# Altium schematic sheet BSPD23-ESF.SchDoc
size 355 x 193 mm
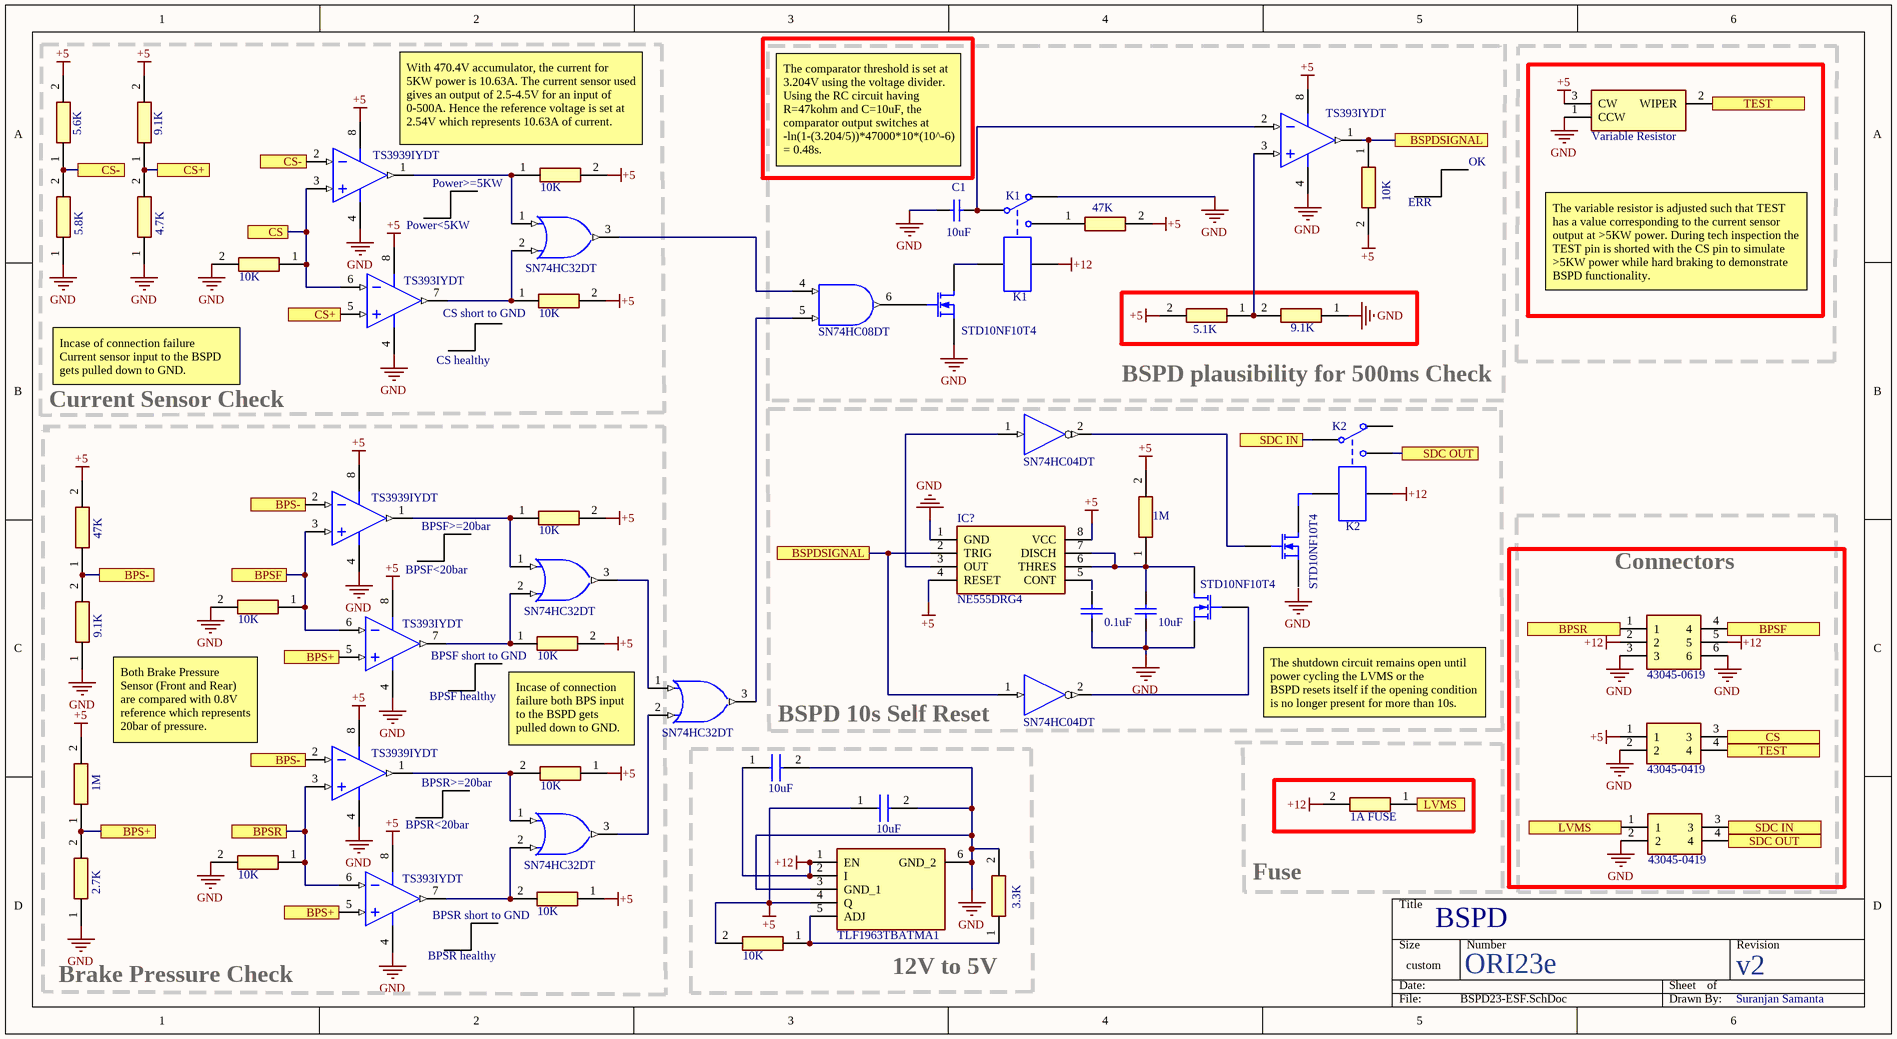
[diagram p0: BSPD23-ESF.SchDoc]

## Parts
(Parts that share a designator on the sheet are numbered #1, #2 ... from top to bottom, then left to right.)
?#1  TS393IYDT  [STM-SO-8_D_L]  (part B of 2)
?#2  STD10NF10T4  [E3]
?#3  TS393IYDT  [STM-SO-8_D_L]  (part B of 2)
?#4  TS393IYDT  [STM-SO-8_D_L]  (part B of 2)
C?#1  C1  value 10uF  [RAD-0.3]
C?#2  0.1uF  [RAD-0.3]
C?#3  10uF  [RAD-0.3]
C?#4  10uF  [CAPC3225X230N]
C?#5  10uF  [CAPC3225X230N]
IC?  NE555DRG4  [SOIC127P600X175-8N]
J?#1  43045-0619  [43045-06YY_181920]
J?#2  43045-0419  [43045-04YY_181920]
J?#3  43045-0419  [43045-04YY_181920]
K?#1  Relay-SPDT  [MODULE5B]  (value not drawn)
K?#2  Relay-SPDT  [MODULE5B]  (value not drawn)
LDO?  TLF1963TBATMA1  [TLS850B0TBV33ATMA1]
Q?#1  STD10NF10T4  [E3]
Q?#2  STD10NF10T4  [E3]
R?#1  10K  [RESC3126X60N]
R?#2  5.6K  [RESC3126X60N]
R?#3  9.1K  [RESC3126X60N]
R?#4  10K  [RESC3126X60N]
R?#5  47K  [RESC3126X60N]
R?#6  5.8K  [RESC3126X60N]
R?#7  4.7K  [RESC3126X60N]
R?#8  10K  [RESC3126X60N]
R?#9  10K  [RESC3126X60N]
R?#10  5.1K  [RESC3126X60N]
R?#11  9.1K  [RESC3126X60N]
R?#12  10K  [RESC3126X60N]
R?#13  1M  [RESC3126X60N]
R?#14  47K  [RESC3126X60N]
R?#15  10K  [RESC3126X60N]
R?#16  10K  [RESC3126X60N]
R?#17  9.1K  [RESC3126X60N]
R?#18  10K  [RESC3126X60N]
R?#19  1A FUSE  [RESC0603X28N]
R?#20  1M  [RESC3126X60N]
R?#21  10K  [RESC3126X60N]
R?#22  10K  [RESC3126X60N]
R?#23  2.7K  [RESC3126X60N]
R?#24  10K  [RESC3126X60N]
R?#25  3.3K  [RESC3126X60N]
U?#1  TS393IYDT  [STM-SO-8_D_L]  (part A of 2)
U?#2  TS3939IYDT  [STM-SO-8_D_L]  (part A of 2)
U?#3  SN74HC32DT  [D0014A_N]  (part A of 5)
U?#4  SN74HC08DT  [D0014A_M]  (part B of 5)
U?#5  SN74HC04DT  [N0014A]  (part A of 7)
U?#6  TS3939IYDT  [STM-SO-8_D_L]  (part A of 2)
U?#7  SN74HC32DT  [D0014A_N]  (part A of 5)
U?#8  SN74HC04DT  [N0014A]  (part A of 7)
U?#9  SN74HC32DT  [D0014A_N]  (part A of 5)
U?#10  TS3939IYDT  [STM-SO-8_D_L]  (part A of 2)
U?#11  SN74HC32DT  [D0014A_N]  (part A of 5)
VR?  Variable Resistor  [3386P1103TLF]

## Blocks framed on the sheet
Connectors: J?#1-J?#3
12V to 5V: C?#4 C?#5 LDO? R?#24 R?#25

## Ports
BPS+, BPS-, BPSF, BPSR, BSPDSIGNAL, CS, CS+, CS-, LVMS, SDC IN, SDC OUT, TEST

## Nets
+5: ?#1.8(VCC+) ?#3.8(VCC+) ?#4.8(VCC+) C?#5.1 IC?.4(RESET) IC?.8(VCC) J?#2.1 LDO?.4(Q) R?#1.2 R?#2.2 R?#3.2 R?#4.2 R?#5.2 R?#9.2 R?#10.2 R?#12.2 R?#13.2 R?#14.2 R?#16.2 R?#18.1 R?#20.2 R?#22.1 R?#24.2 U?#2.8(VCC+) U?#6.8(VCC+) U?#10.8(VCC+) VR?.3(CW)
+12: C?#4.1 J?#1.2 J?#1.5 K?#1.5 K?#2.5 LDO?.1(EN) LDO?.2(I) R?#19.2
GND: ?#1.4(VCC-) ?#2.3(S) ?#3.4(VCC-) ?#4.4(VCC-) C?#1.1 C?#2.1 C?#3.1 C?#4.2 C?#5.2 IC?.1(GND) J?#1.3 J?#1.6 J?#2.2 J?#3.2 K?#1.2 LDO?.3(GND_1) LDO?.6(GND_2) Q?#2.3(S) R?#6.1 R?#7.1 R?#8.2 R?#11.1 R?#15.2 R?#17.1 R?#21.2 R?#23.1 R?#25.2 U?#1.4(VCC-) U?#2.4(VCC-) U?#6.4(VCC-) U?#10.4(VCC-) VR?.1(CCW)
BPS+: ?#3.5(IN2+) ?#4.5(IN2+) R?#20.1 R?#23.2 ; port BPS+
BPS-: R?#14.1 R?#17.2 U?#6.2(IN1-) U?#10.2(IN1-) ; port BPS-
BPSF: ?#3.6(IN2-) J?#1.4 R?#15.1 U?#6.3(IN1+) ; port BPSF
BPSR: ?#4.6(IN2-) J?#1.1 R?#21.1 U?#10.3(IN1+) ; port BPSR
BSPDSIGNAL: IC?.2(TRIG) R?#1.1 U?#1.1(OUT1) U?#8.1(1A) ; port BSPDSIGNAL
CS: ?#1.6(IN2-) J?#2.3 R?#8.1 U?#2.3(IN1+) ; port CS
CS+: ?#1.5(IN2+) R?#3.1 R?#7.2 ; port CS+
CS-: R?#2.1 R?#6.2 U?#2.2(IN1-) ; port CS-
LVMS: J?#3.1 R?#19.1 ; port LVMS
SDC IN: J?#3.3 K?#2.1 ; port SDC IN
SDC OUT: J?#3.4 K?#2.3 ; port SDC OUT
TEST: J?#2.4 VR?.2(WIPER) ; port TEST
Net?#1_7: ?#1.7(OUT2) R?#9.1 U?#3.2(1B)
Net?#2_1: ?#2.1(D) K?#1.4
Net?#2_2: ?#2.2(G) U?#4.6(2Y)
Net?#3_7: ?#3.7(OUT2) R?#16.1 U?#7.2(1B)
Net?#4_7: ?#4.7(OUT2) R?#22.2 U?#11.2(1B)
NetC?#1_2: C?#1.2 K?#1.1 U?#1.2(IN1-)
NetC?#3_2: C?#3.2 IC?.6(THRES) IC?.7(DISCH) Q?#2.1(D) R?#13.1
NetIC?_3: IC?.3(OUT) U?#5.1(1A)
NetK?#1_3: K?#1.3 R?#5.1
NetLDO?_5: LDO?.5(ADJ) R?#24.1 R?#25.1
NetQ?#1_2: Q?#1.2(G) U?#5.2(~{1Y})
NetQ?#2_2: Q?#2.2(G) U?#8.2(~{1Y})
NetR?#4_1: R?#4.1 U?#2.1(OUT1) U?#3.1(1A)
NetR?#10_1: R?#10.1 R?#11.2 U?#1.3(IN1+)
NetR?#12_1: R?#12.1 U?#6.1(OUT1) U?#7.1(1A)
NetR?#18_2: R?#18.2 U?#10.1(OUT1) U?#11.1(1A)
NetU?#3_3: U?#3.3(1Y) U?#4.4(2A)
NetU?#4_5: U?#4.5(2B) U?#9.3(1Y)
NetU?#7_3: U?#7.3(1Y) U?#9.1(1A)
NetU?#9_2: U?#9.2(1B) U?#11.3(1Y)

Not connected (* = marked no-connect by the designer): C?#2 2; IC? 5(CONT); K?#2 2 4; Q?#1 1(D) 3(S); U?#1 8(VCC+)

## Notes on the sheet
- (near U?#2) With 470.4V accumulator, the current for 5KW power is 10.63A. The current sensor used gives an output of 2.5-4.5V for an input of 0-500A. Hence the reference voltage is set at 2.54V which represents 10.63A of current.
- The comparator threshold is set at 3.204V using the voltage divider. Using the RC circuit having R=47kohm and C=10uF, the comparator output switches at -ln(1-(3.204/5))*47000*10*(10^-6) = 0.48s.
- OK
- Power<5KW
- Power>=5KW
- (near K?#1) K1
- (near R?#1) ERR
- (near R?#9) CS short to GND
- The variable resistor is adjusted such that TEST has a value corresponding to the current sensor output at >5KW power. During tech inspection the TEST pin is shorted with the CS pin to simulate >5KW power while hard braking to demonstrate BSPD functionality.
- Incase of connection failure Current sensor input to the BSPD gets pulled down to GND.
- (near ?#1) CS healthy
- BSPD plausibility for 500ms Check
- Current Sensor Check
- (near K?#2) K2
- BPSF<20bar
- BPSF>=20bar
- (near ?#3) BPSF healthy
- BPSF short to GND
- (near U?#8) BSPD 10s Self Reset
- (near Q?#2) The shutdown circuit remains open until power cycling the LVMS or the
  BSPD resets itself if the opening condition is no longer present for more than 10s.
- (near R?#17) Both Brake Pressure Sensor (Front and Rear) are compared with 0.8V reference which represents 20bar of pressure.
- BPSR>=20bar
- (near R?#18) Incase of connection failure both BPS input to the BSPD gets pulled down to GND.
- (near U?#10) BPSR<20bar
- (near R?#22) BPSR short to GND
- Fuse
- Brake Pressure Check
- BPSR healthy
- BSPD
- ORI23e
- v2
- Suranjan Samanta
- Labels drawn without touching a wire or pin: +5, GND

## Library data of the parts
?#1 ?#3 ?#4 U?#1 U?#2 U?#6 U?#10 = CMP-2000-06550-1: Low-Power, Dual-Voltage Comparator, 2 to 36 V, 0 to 70 degC, 8-Pin SOIC (SO), RoHS, Tape and Reel; Manufacturer: STMicroelectronics; Voltage - Supply, Single/Dual (±): 2V~36V,±1V~18V; Current - Input Bias (Max): 0.25µA@5V; Number of Elements: 2; Current - Output (Typ): 18mA@5V; Other Names: 497-1593-2; Voltage - Input Offset (Max): 5mV@30V; Output Type: CMOS,DTL,ECL,MOS,Open-Collector,TTL; EDA / CAD Models: DownloadfromAcceleratedDesigns; Other Related Documents: LM393ViewAllSpecificationsLM393ViewAllSpecifications; Online Catalog: Comparators-2elements; Current - Quiescent (Max): 2.5mA; Standard Package: 2,500; Manufacturer URL: http://www.st.com/; Package Description: 8-Pin Small Outline Integrated Circuit, Body 4.9 x 3.9 mm, Pitch 1.27 mm; Packaging: Tape&Reel(TR); Datasheet Version: Rev. 15, 02/2016; Category: IntegratedCircuits(ICs); Operating Temperature: 0°C~70°C; Mounting Type: SurfaceMount; Supplier Device Package: 8-SO; Datasheet URL: http://www.st.com/content/ccc/resource/technical/document/datasheet/group1/b4/cc/cf/13/18/28/44/f5/CD00000465/files/CD00000465.pdf/jcr:content/translations/en.CD00000465.pdf; Family: Linear-Comparators; Mounting Technology: SurfaceMount; Type: GeneralPurpose; Package Reference: SO-8; Package / Case: 8-SOIC(0.154",3.90mmWidth)
?#2 Q?#1 Q?#2 = MOSFET-N: N-Channel MOSFET; Published: 8-Jun-2000; LatestRevisionDate: 17-Jul-2002; LatestRevisionNote: Re-released for DXP Platform.; PackageVersion: 1995/1996; PackageReference: E3; Publisher: Altium Limited; PackageDescription: TO, Flat Index; 3 In-Line, Axial Leads; Body Dia. 4.6mm; Lead Dia. 0.5 mm (max)
C?#1-C?#3 = Cap: Capacitor; Published: 8-Jun-2000; LatestRevisionDate: 17-Jul-2002; LatestRevisionNote: Re-released for DXP Platform.; PackageReference: RAD-0.3; Publisher: Altium Limited; PackageDescription: Radial Cap, Thru-Hole; 2 Leads; 0.3 in Pin Spacing
C?#4 C?#5 = C3225X7R1N106K250AC: Capacitor; Manufacturer_Name: TDK; Datasheet Link: https://componentsearchengine.com/Datasheets/1/C3225X7R1N106K250AC.pdf; Height: 2.3mm; Mouser2 Part Number: 810-C3225X7R1N106K25; Mouser2 Price/Stock: https://www.mouser.com/Search/Refine.aspx?Keyword=810-C3225X7R1N106K25; Manufacturer_Part_Number: C3225X7R1N106K250AC
IC? = NE555DRG4: Integrated Circuit; Manufacturer_Name: Texas Instruments; Datasheet Link: http://www.mouser.com/ds/2/405/ne555-557499.pdf; Height: 1.75mm; Manufacturer_Part_Number: NE555DRG4; Mouser Part Number: 595-NE555DRG4; Mouser Price/Stock: https://www.mouser.co.uk/ProductDetail/Texas-Instruments/NE555DRG4?qs=rLYyFdxB%2FmreBHawQCpQ0Q%3D%3D; Arrow Part Number: NE555DRG4; Arrow Price/Stock: https://www.arrow.com/en/products/ne555drg4/texas-instruments?region=nac
J?#1 = 43045-0619: Connector; Manufacturer_Name: Molex; Datasheet Link: https://www.molex.com/pdm_docs/sd/430450218_sd.pdf; Height: 9.91mm; Manufacturer_Part_Number: 43045-0619; Mouser Part Number: 538-43045-0619; Mouser Price/Stock: https://www.mouser.co.uk/ProductDetail/Molex/43045-0619?qs=KC2ywxza1kr7EVu5MuTw7g%3D%3D; Arrow Part Number: 43045-0619; Arrow Price/Stock: https://www.arrow.com/en/products/43045-0619/molex
J?#2 J?#3 = 43045-0419: Connector; Manufacturer_Name: Molex; Datasheet Link: https://www.molex.com/pdm_docs/sd/430450218_sd.pdf; Height: 9.91mm; Manufacturer_Part_Number: 43045-0419; Mouser Part Number: 538-43045-0419; Mouser Price/Stock: https://www.mouser.co.uk/ProductDetail/Molex/43045-0419?qs=UeCeOHRHQebVNIQyI9VWWg%3D%3D
K?#1 K?#2 = Relay-SPDT: Single-Pole Dual-Throw Relay; Published: 24-Mar-1999; LatestRevisionDate: 17-Jul-2002; LatestRevisionNote: Re-released for DXP Platform.; PackageReference: MODULE5B; Publisher: Altium Limited
LDO? = TLF1963TBATMA1: Integrated Circuit; Manufacturer_Name: Infineon; Datasheet Link: https://www.infineon.com/dgdl/Infineon-TLF1963-DS-v01_00-EN.pdf?fileId=5546d46258fc0bc1015969d2981941e0; Height: 4.4mm; Manufacturer_Part_Number: TLF1963TBATMA1; Mouser Part Number: 726-TLF1963TBATMA1; Mouser Price/Stock: https://www.mouser.com/Search/Refine.aspx?Keyword=726-TLF1963TBATMA1
R?#1-R?#18 R?#20-R?#25 = RC1210JR-0710KL: Resistor; Manufacturer_Name: YAGEO (PHYCOMP); Datasheet Link: http://www.yageo.com/documents/recent/PYu-RC1210_51_RoHS_L_(4).pdf; Height: 0.6mm; Manufacturer_Part_Number: RC1210JR-0710KL; Mouser Part Number: 603-RC1210JR-0710KL; Mouser Price/Stock: https://www.mouser.com/Search/Refine.aspx?Keyword=603-RC1210JR-0710KL
R?#19 = CPF0201D100RE1: Resistor; Manufacturer_Name: TE Connectivity; Datasheet Link: http://www.te.com/commerce/DocumentDelivery/DDEController?Action=showdoc&DocId=Data+Sheet%7F1773200-1%7FA%7Fpdf%7FEnglish%7FENG_DS_1773200-1_A.pdf%7F4-2176215-6; Height: 0.28mm; Manufacturer_Part_Number: CPF0201D100RE1; Mouser Part Number: 279-CPF0201D100RE1; Mouser Price/Stock: https://www.mouser.com/Search/Refine.aspx?Keyword=279-CPF0201D100RE1; RS Part Number: 7549192; RS Price/Stock: http://uk.rs-online.com/web/p/products/7549192
U?#3 U?#7 U?#9 U?#11 = CMP-1573-00005-3: Quadruple 2-Input Positive-OR Gates, D0014A, SMALL T&R; Manufacturer: Texas Instruments; Rating: Catalog; Input Type: CMOS; Voltage(Nom)(V): 5; F @ Nom Voltage(Max)(Mhz): 70; Bits(#): 4; VCC(Min)(V): 2; VCC(Max)(V): 6; Output Drive (IOL/IOH)(Max)(mA): 5.2/-5.2; tpd @ Nom Voltage(Max)(ns): 25; ICC @ Nom Voltage(Max)(mA): 0.02; PackageVersion: http://www.ti.com/lit/ml/mpds177g/mpds177g.pdf; Operating Temperature Range(C): -40 to 85; Code_JEDEC: MS-012; PackageReference: D0014A; DatasheetVersion: SCLS200D; Output Type: CMOS; Generic Part Number: SN74HC32
U?#4 = CMP-0777-00018-3: Quadruple 2-Input Positive-AND Gates, D0014A, SMALL T&R; Manufacturer: Texas Instruments; VCC(Max)(V): 6; ICC @ Nom Voltage(Max)(mA): 0.02; Bits(#): 4; Voltage(Nom)(V): 5; VCC(Min)(V): 2; Technology Family: HC; Schmitt Trigger: No; F @ Nom Voltage(Max)(Mhz): 70; tpd @ Nom Voltage(Max)(ns): 28; Output Type: CMOS; Rating: Catalog; DatasheetVersion: SCLS081F; Generic Part Number: SN74HC08; Operating Temperature Range(C): -40 to 85; PackageReference: D0014A; Input Type: CMOS
U?#5 U?#8 = CMP-1615-00872-2: Hex inverters, N0014A, TUBE; Generic Part Number: SN7404; Manufacturer: Texas Instruments; Voltage(Nom)(V): 5; Bits(#): 6; tpd @ Nom Voltage(Max)(ns): 22; Schmitt Trigger: No; VCC(Max)(V): 5.25; ICC @ Nom Voltage(Max)(mA): 0.033; Technology Family: TTL; Rating: Catalog; F @ Nom Voltage(Max)(Mhz): 35; Output Type: CMOS; VCC(Min)(V): 4.75; Output Drive (IOL/IOH)(Max)(mA): -0.4/16; DatasheetVersion: SDLS029C; Code_JEDEC: MS-001; Operating Temperature Range(C): 0 to 70; PackageReference: N0014A; Input Type: TTL
VR? = 3386P-1-103: Manufacturer_Name: Bourns; Datasheet Link: https://www.mouser.com/datasheet/2/54/3386-776606.pdf; Height: 4.83mm; Manufacturer_Part_Number: 3386P-1-103; Mouser Part Number: 652-3386P-1-103; Mouser Price/Stock: https://www.mouser.co.uk/ProductDetail/Bourns/3386P-1-103?qs=8ovTl4njQkUNVfkrJ%252Bl%2Fgw%3D%3D; Arrow Part Number: 3386P-1-103; Arrow Price/Stock: https://www.arrow.com/en/products/3386p-1-103/bourns?region=nac